# Altium schematic sheet BaseFunctions.SchDoc
size 297 x 209 mm; SheetNumber: 2; SheetTotal: 5; swcgroup: Innovation and Research; Org: Sainsbury Wellcome Centre; Add1: 25 Howland Street; Add2: London; Add3: W1T 4JG; WebAddress: www.sainsburywellcome.org; SheetSize: A4; SheetName: Base Functions
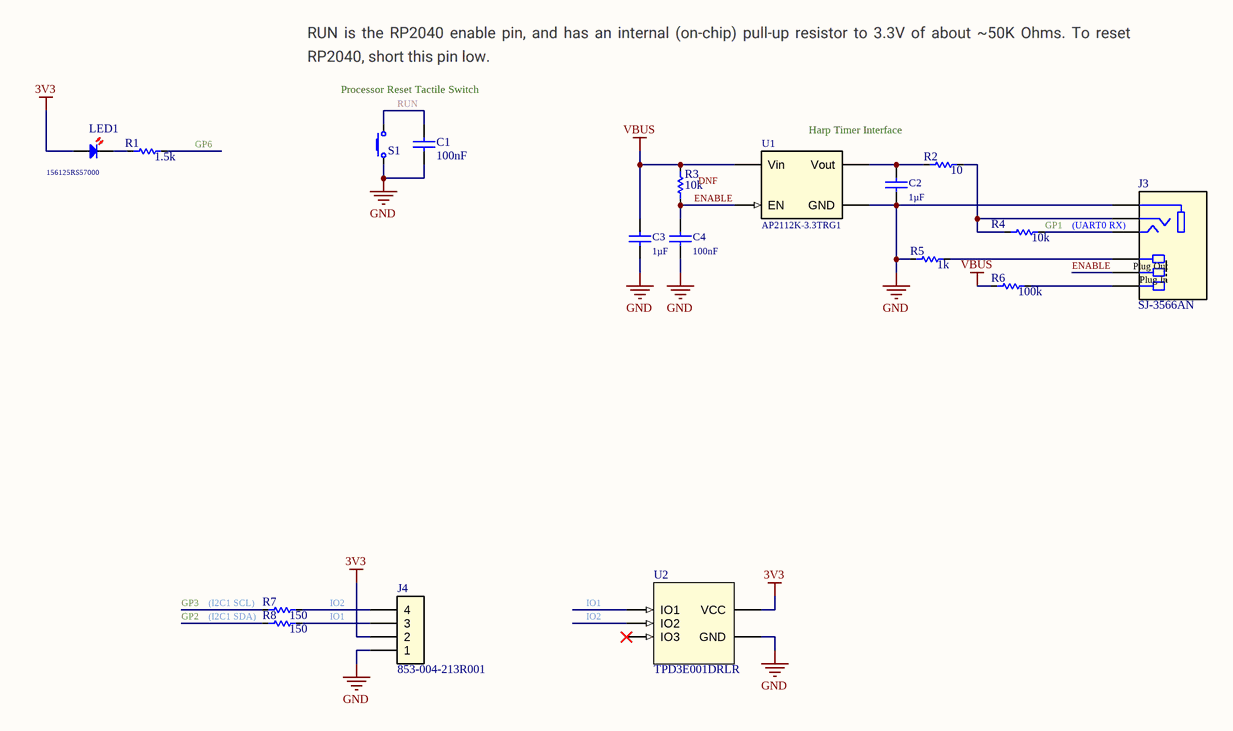
[diagram p0: BaseFunctions.SchDoc]

## Parts
C1  value 100nF  [FP-GRM188-0_1-e0_2_0_5-IPC_B]  (hidden comment: C0603-100nF-100V-10%-X7R)
C2  value 1µF  [FP-GRM188-0_1-e0_2_0_5-IPC_B]  (hidden comment: C0603-1uF-25V-10%-X7R)
C3  value 1µF  [FP-GRM188-0_1-e0_2_0_5-IPC_B]  (hidden comment: C0603-1uF-25V-10%-X7R)
C4  value 100nF  [FP-GRM188-0_1-e0_2_0_5-IPC_B]  (hidden comment: C0603-100nF-100V-10%-X7R)
J3  SJ-3566AN  [CUI_SJ-3566AN - RM]
J4  853-004-213R001  [853-004-213R00Y]
LED1  156125RS57000  [WL-SMRD_1205_normal use]
R1  value 1.5k  [FP-CPF0603-IPC_B]  (hidden comment: R0603-1k5-1/16W-0.1%)
R2  value 10  [FP-CPF0603-IPC_B]  (hidden comment: R0603-10R-1/16W-0.1%)
R3  value 10k  [FP-CPF0603-IPC_B]  (hidden comment: R0603-10k-1/16W-0.1%)
R4  value 10k  [FP-CPF0603-IPC_B]  (hidden comment: R0603-10k-1/16W-0.1%)
R5  value 1k  [FP-CPF0603-IPC_B]  (hidden comment: R0603-1k-1/16W-0.1%)
R6  value 100k  [FP-CPF0603-IPC_B]  (hidden comment: R0603-100k-1/16W-0.1%)
R7  value 150  [FP-CPF0603-IPC_B]  (hidden comment: R0603-150R-1/16W-0.1%)
R8  value 150  [FP-CPF0603-IPC_B]  (hidden comment: R0603-150R-1/16W-0.1%)
S1  PTS645VM83-2LFS  [PTS645VM83-2LFS]  (value not drawn)
U1  AP2112K-3.3TRG1  [FP-SOT25-IPC_B]
U2  TPD3E001DRLR  [DRL5_TEX]

## Nets
3V3: J4.2 LED1.1(A) U2.5(VCC)
GND: C1.1 C2.1 C3.1 C4.1 J3.1 J4.1 R5.1 S1.1 U1.2(GND) U2.3(GND)
VBUS: C3.2 R3.2 R6.1 U1.1(Vin)
ENABLE: C4.2 J3.5 R3.1 U1.3(EN)
GP1: J3.2 R4.2
GP2: R8.1
GP3: R7.1
GP6: R1.2
IO1: J4.3 R8.2 U2.1(IO1)
IO2: J4.4 R7.2 U2.2(IO2)
RUN: C1.2 S1.2
NetC2_2: C2.2 R2.1 U1.5(Vout)
NetJ3_3: J3.3 R2.2 R4.1
NetJ3_4: J3.4 R5.2
NetJ3_6: J3.6 R6.2
NetLED1_2: LED1.2(K) R1.1

Not connected (* = marked no-connect by the designer): U2 4(IO3)*

## Notes on the sheet
- Processor Reset Tactile Switch
- Harp Timer Interface
- (near R3) DNF
- (near J3) (UART0 RX)
- (I2C1 SDA)
- (I2C1 SCL)
- FILE
- VARIANT
- DATE
- REVISION
- SHEET
- /
- PROJECT
- SIZE
- (in symbol CMP-300-0000-5) Plug Out; Plug In

## Library data of the parts
C1 C4 = CMP-611-0027-15: 0.1µF ±10% 100V Ceramic Capacitor X7R 0603 (1608 Metric); Pick&PlaceFootprint: 0603_CAP; Mount: Surface Mount; Voltage Rating: 100V; Min Operating Temperature: -55°C; Termination: SMD/SMT; Width: 0.8mm; Series: GRM; Packaging: Tape and Reel; Size: 0.8mm; Case Code (Metric): 1608; REACH SVHC: No SVHC; Case/Package: 0603; Construction: Flat; Dielectric: X7R; Weight: 0.000222oz; Height: 0.8mm; Tolerance: 10%; Package Quantity: 1; Lead Free: Lead Free; Voltage: 100V; RoHS Compliant: Yes; Capacitance: 100nF; Thickness: 0.035inch; Radiation Hardening: No; Depth: 0.8mm; Length: 1.6mm; Max Operating Temperature: 125°C; Material: Ceramic; Case Code (Imperial): 0603; Voltage Rating (DC): 100V; Capacitor Type: Ceramic; RoHS: Yes
C2 C3 = CMP-611-0033-2: 1µF ±10% 25V Ceramic Capacitor X7R 0603 (1608 Metric); Capacitance: 1uF; Pick&PlaceFootprint: 0603_CAP; Depth: 0.8mm; Width: 0.8mm; Dielectric: X7R; Thickness: 0.035inch; Capacitor Type: Ceramic; Package Quantity: 1; Max Operating Temperature: 125°C; Mount: Surface Mount; Termination: Wraparound; Case/Package: 0603; Lead Free: Lead Free; RoHS Compliant: Yes; Case Code (Imperial): 0603; Min Operating Temperature: -55°C; Size: 0.8mm; REACH SVHC: Yes; Height: 0.9mm; Packaging: Tape and Reel; Voltage Rating (DC): 25V; Series: GRM; Length: 1.6mm; Material: Ceramic; Case Code (Metric): 1608; Weight: 0.000222oz; Voltage: 25V; Tolerance: 10%; RoHS: Yes; Construction: Flat; Voltage Rating: 25V; Radiation Hardening: No
J3 = CMP-300-0000-5: 3.5 mm, Stereo, Right Angle, Through Hole, SPDT Switch, Audio Jack Connector; DIN Conformance: No; Pick&PlaceFootprint: SJ-356xxx; Number of Poles: 3; Option: General Purpose; Number of Ports: 1; Connector Type: AUDIO/RCA CONNECTOR; REACH SVHC: Yes; MIL Conformance: No; Contact Finish - Mating: NOT SPECIFIED; IEC Conformance: No; Mount: Through Hole; PartNumber: SJ-3566AN; Body/Shell Style: JACK; RoHS Compliant: Yes; Termination: Solder
J4 = CMP-370-0028-2: CONN PLUG FMALE 4POS GOLD SOLDER; Connector Type: Receptacle; Ratings: IP67,Waterproof,Dust Tight; Current Rating: 1A; Number of Positions: 4; Voltage Rating: 60V; Packaging: Tray; Min Operating Temperature: -40°C; REACH SVHC: No SVHC; Max Operating Temperature: 85°C; Fastening Type: Threaded; RoHS Compliant: Yes; Termination: Solder; Number of Pins: 4; Contact Plating: Gold; Mount: Through Hole,Panel
LED1 = CMP-520-0011-1: Single Color LED; pin to pad: 1>2 2>1; REACH SVHC: Yes; PartNumber: 156125RS57000; Optoelectronic Device Type: SINGLE COLOR LED; RoHS Compliant: Yes; Mount: Surface Mount
R1 = CMP-633-0029-14: Surface Mount Resistor 1k5 Ohm 1/16 W 0.1% 0603 (1608 Metric); Voltage Rating: 50V; Number of Resistors: 1; Max Power Dissipation: 62.5 mW; Power Rating: 62.5mW; Pick&PlaceFootprint: R0603; Temperature Coefficient: 25ppm/°C; REACH SVHC: No SVHC; Min Operating Temperature: -55°C; Height: 0.45mm; ELV: Compliant; Termination: Solder; Width: 0.8mm; Technology: Thin Film; Composition: Thin Film; Weight: 7.1E-05oz; Length: 1.6mm; RoHS: Yes; RoHS Compliant: Yes; Resistance: 1.5k; Resistor Type: Thin Film; Tolerance: 0.1%; Number of Terminations: 2; Resistance Tolerance: 0.1%; Voltage Rating (DC): 50V; Case Code (Imperial): 0603; Number of Pins: 2; Mount: Surface Mount; Size Code: 0603; Series: CPF; Packaging: Tape and Reel; Max Operating Temperature: 155°C; Case Code (Metric): 1608; Case/Package: 0603
R2 = CMP-633-0069-10: Surface Mount Resistor 10 Ohm 1/16 W 0.1% 0603 (1608 Metric); Power Rating: 62.5mW; Pick&PlaceFootprint: R0603; Number of Resistors: 1; Voltage Rating: 50V; Temperature Coefficient: 25ppm/°C; Max Power Dissipation: 62.5 mW; Termination: Solder; Max Operating Temperature: 155°C; RoHS: Yes; Length: 1.6mm; Height: 0.45mm; REACH SVHC: No SVHC; Weight: 7.1E-05oz; ELV: Compliant; Resistance Tolerance: 0.1%; Min Operating Temperature: -55°C; Size Code: 0603; Packaging: Tape and Reel; Number of Pins: 2; Case Code (Metric): 1608; Tolerance: 0.1%; Composition: Thin Film; Series: CPF; Case/Package: 0603; Width: 0.8mm; Resistance: 10; Resistor Type: Thin Film; RoHS Compliant: Yes; Number of Terminations: 2; Voltage Rating (DC): 50V; Technology: Thin Film; Mount: Surface Mount; Case Code (Imperial): 0603
R3 R4 = CMP-633-0002-15: Surface Mount Resistor 10k Ohm 1/16 W 0.1% 0603 (1608 Metric); Max Power Dissipation: 62.5 mW; Temperature Coefficient: 25ppm/°C; Voltage Rating: 50V; Number of Resistors: 1; Pick&PlaceFootprint: R0603; Power Rating: 62.5mW; Case Code (Metric): 1608; Tolerance: 0.1%; Resistor Type: Thin Film; Case/Package: 0603; Number of Terminations: 2; Packaging: Tape and Reel; Height: 0.45mm; Termination: Solder; Size Code: 0603; Resistance: 10k; Case Code (Imperial): 0603; Technology: Thin Film; Min Operating Temperature: -55°C; RoHS: Yes; ELV: Compliant; Resistance Tolerance: 0.1%; Weight: 7.1E-05oz; Series: CPF; Composition: Thin Film; Voltage Rating (DC): 50V; Length: 1.6mm; REACH SVHC: No SVHC; Mount: Surface Mount; RoHS Compliant: Yes; Number of Pins: 2; Width: 0.8mm; Max Operating Temperature: 155°C
R5 = CMP-633-0013-15: Surface Mount Resistor 1k Ohm 1/16 W 0.1% 0603 (1608 Metric); Power Rating: 62.5mW; Voltage Rating (DC): 50V; Pick&PlaceFootprint: R0603; Number of Resistors: 1; Max Power Dissipation: 62.5 mW; Temperature Coefficient: 25ppm/°C; Weight: 7.1E-05oz; Composition: Thin Film; Case Code (Metric): 1608; Resistor Type: Thin Film; Length: 1.6mm; Case/Package: 0603; Height: 0.45mm; Size Code: 0603; Width: 0.8mm; Packaging: Tape and Reel; RoHS Compliant: Yes; Voltage Rating: 50V; Resistance Tolerance: 0.1%; Case Code (Imperial): 0603; Number of Pins: 2; Mount: Surface Mount; Termination: Solder; Resistance: 1k; RoHS: Yes; Series: CPF; Technology: Thin Film; Min Operating Temperature: -55°C; REACH SVHC: No SVHC; ELV: Compliant; Max Operating Temperature: 155°C; Tolerance: 0.1%; Number of Terminations: 2
R6 = CMP-633-0000-17: Surface Mount Resistor 100k Ohm 1/16 W 0.1% 0603 (1608 Metric); Max Power Dissipation: 62.5 mW; Voltage Rating (DC): 50V; Pick&PlaceFootprint: R0603; Power Rating: 62.5mW; Number of Resistors: 1; Temperature Coefficient: 25ppm/°C; RoHS: Yes; Mount: Surface Mount; Min Operating Temperature: -55°C; Case Code (Metric): 1608; Case/Package: 0603; Number of Pins: 2; Packaging: Tape and Reel; Height: 0.45mm; Case Code (Imperial): 0603; Max Operating Temperature: 155°C; Number of Terminations: 2; Length: 1.6mm; Weight: 7.1E-05oz; ELV: Compliant; Series: CPF; Tolerance: 0.1%; Resistance Tolerance: 0.1%; Width: 0.8mm; Technology: Thin Film; Voltage Rating: 50V; Resistance: 100k; REACH SVHC: No SVHC; RoHS Compliant: Yes; Resistor Type: Thin Film; Composition: Thin Film; Termination: Solder; Size Code: 0603
R7 R8 = CMP-633-0078-2: Surface Mount Resistor 150 Ohm 1/16 W 0.1% 0603 (1608 Metric); Number of Resistors: 1; Pick&PlaceFootprint: R0603; Temperature Coefficient: 25ppm/°C; Power Rating: 62.5mW; Voltage Rating: 50V; Max Power Dissipation: 62.5 mW; Max Operating Temperature: 155°C; Series: CPF; RoHS: Yes; Case Code (Metric): 1608; Width: 0.8mm; Construction: Chip; Length: 1.6mm; Composition: Thin Film; Min Operating Temperature: -55°C; REACH SVHC: Yes; RoHS Compliant: Yes; Height: 0.45mm; Termination: Wraparound; Packaging: Tape and Reel; Resistance: 150; Size Code: 0603; Technology: THIN FILM; ELV: Compliant; Weight: 7.1E-05oz; Tolerance: 0.1%; Number of Pins: 2; Resistance Tolerance: 0.1%; Resistor Type: FIXED RESISTOR; Mount: Surface Mount; Number of Terminations: 2; Case Code (Imperial): 0603; Voltage Rating (DC): 50V; Case/Package: 0603
S1 = CMP-B00-0002-2: Switch Tactile N.O. SPST Round Button PC Pins 0.05A 12VDC 100000Cycles 1.57N Bracket Mount/Through Hole Bulk; Voltage Rating (DC): 12V; Current Rating: 50mA; Switch Function: Off-Mom; Actuator Type: Standard; Illumination Type: Non-Illuminated; Actuator Material: Nylon,Polyamide,PA66; Mechanical Life: 100000Cycles; Termination: PC Pins; Max Current Rating: 50mA; Operating Force: 1.57N; Max Operating Temperature: 60°C; Depth: 12.3mm; Package Quantity: 1000; Orientation: Right Angle; Min Operating Temperature: -20°C; Mount: Through Hole; Contact Plating: Silver; Series: PTS645; Throw Configuration: SPST; Length: 7.5mm; Packaging: Bulk; RoHS Compliant: Yes; Color: Black
U1 = CMP-970-0025-2: Fixed Positive LDO Regulator, 3.3V, 0.4V Dropout, CMOS, PDSO5; Dropout Voltage1-Max: 400mV; Output Current1-Max: 600mA; Qualification Status: Not Qualified; Voltage Tolerance-Max: 1.5%; Package Equivalence Code: TSOP5/6,.11,37; Pick&PlaceFootprint: SOT25; Number of Outputs: 1; Output Voltage1-Min: 3.2505V; Output Voltage1-Max: 3.3495V; Line Regulation-Max: 0.00561%; Regulator Type: FIXED POSITIVE SINGLE OUTPUT LDO REGULATOR; Input Voltage Absolute-Max: 6.5V; Package Body Material: Plastic; Dropout Voltage1-Nom: 250mV; Max Input Voltage: 6V; Min Input Voltage: 2.5V; Load Regulation-Max: 0.0198%; Terminal Position: DUAL; Output Voltage1-Nom: 3.3V; Adjustability: FIXED; PartNumber: AP2112K-3.3TRG1; Terminal Finish: Tin; Number of Pins: 5; Width: 1.6mm; Length: 2.92mm; REACH SVHC: Yes; JESD-609 Code: e3; RoHS Compliant: Yes; Technology: CMOS; Height - Seated (Max): 1.45mm; Packaging: Tape and Reel; JESD-30 Code: R-PDSO-G5; Operating Temperature, TJ-Min: -40°C; Operating Temperature, TJ-Max: 85°C; Moisture Sensitivity Level: 3; Terminal Form: Gull Wing; Surface Mount: Yes; Max Operating Temperature: 85°C; Terminal Pitch: 0.95mm; Package Style: SMALL OUTLINE, LOW PROFILE, SHRINK PITCHMeter; Number of Functions: 1; Package Code: LSSOP; Min Operating Temperature: -40°C; Package Shape: Rectangular
U2 = CMP-820-0000-4: Low-Capacitance 3-Channel +/-15KV ESD-Protection Array for High-Speed Data Interfaces 5-SOT-5X3; Pick&PlaceFootprint: DRL-5; Mount: Surface Mount; PartNumber: TPD3E001DRLR